# Altium schematic sheet PERIPHERALS.SchDoc: PERIPHERALS
size A3; ApprovedBy: TRAN VAN THANG; Author: MINH NHAT; Revision: 6.6.6; SheetNumber: 5; SheetTotal: 6; ProjectTitle: LOAPAY 4G WIFI
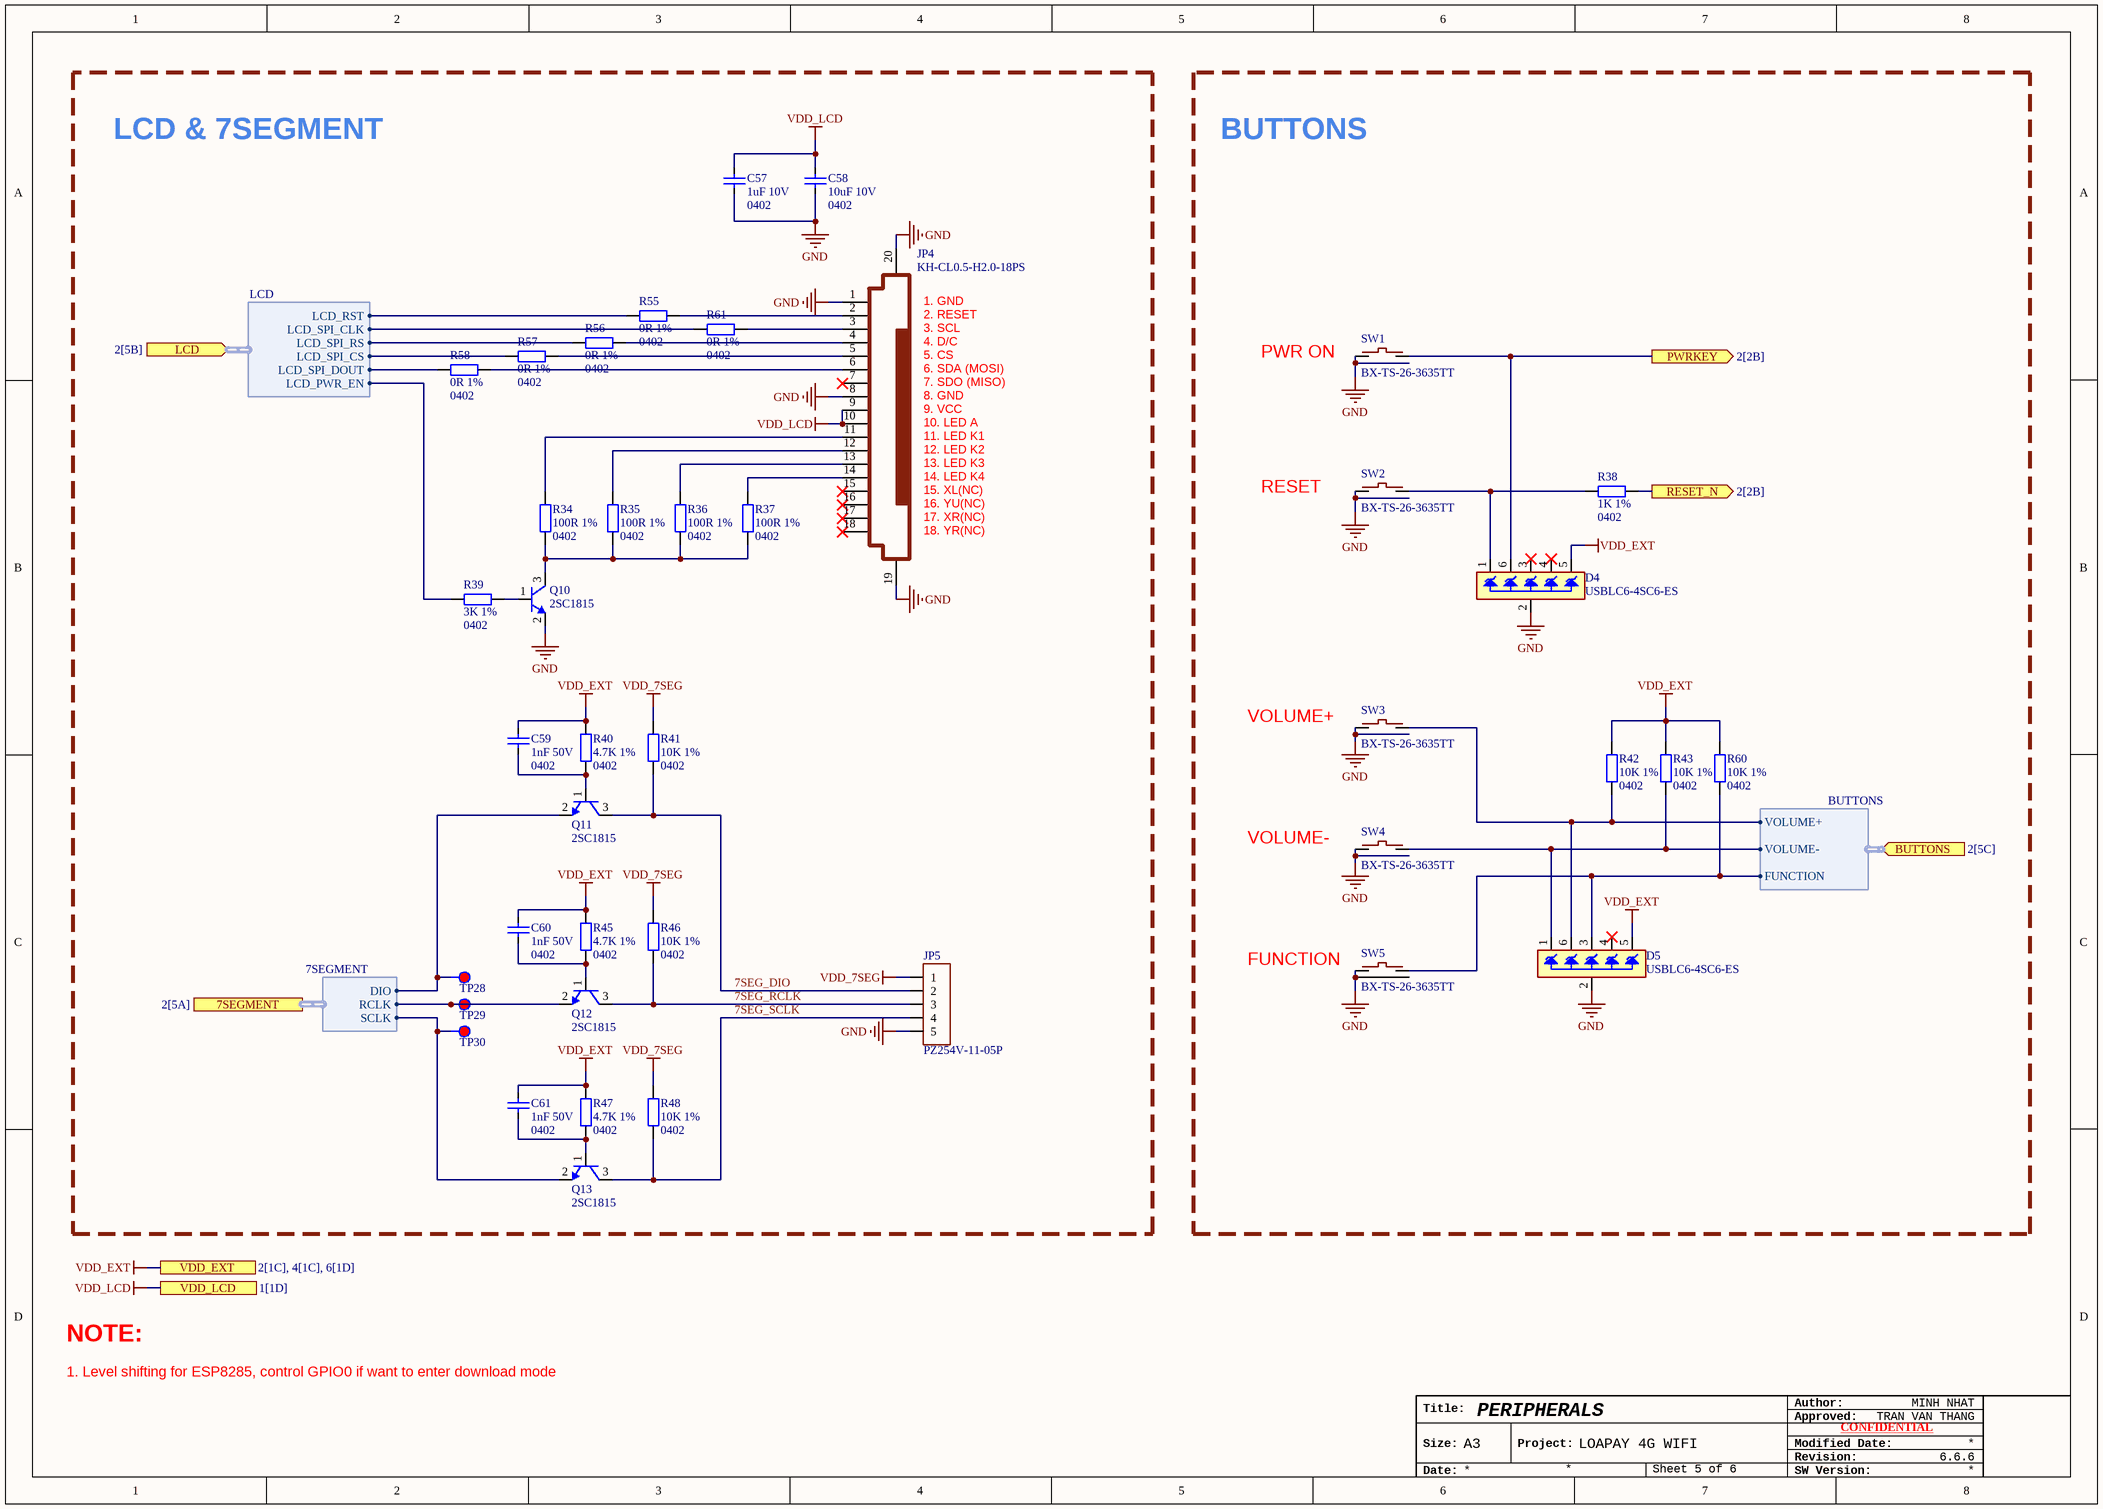
[diagram p0: PERIPHERALS.SchDoc]

## Parts
C57  1uF 10V  Package: 0402  [C0402_2]
C58  10uF 10V  Package: 0402  [C0402_2]
C59  1nF 50V  Package: 0402  [C0402_2]
C60  1nF 50V  Package: 0402  [C0402_2]
C61  1nF 50V  Package: 0402  [C0402_2]
D4  USBLC6-4SC6-ES  [D_SOT23-6]
D5  USBLC6-4SC6-ES  [D_SOT23-6]
JP4  KH-CL0.5-H2.0-18PS  [FPC-SMD-18P-TOP]
JP5  PZ254V-11-05P  [JP5_M_SMD - 2]
Q10  2SC1815  [TF_SOT_23_3]
Q11  2SC1815  [TF_SOT_23_3]
Q12  2SC1815  [TF_SOT_23_3]
Q13  2SC1815  [TF_SOT_23_3]
R34  100R 1%  Package: 0402  [RES_SMD_0402]
R35  100R 1%  Package: 0402  [RES_SMD_0402]
R36  100R 1%  Package: 0402  [RES_SMD_0402]
R37  100R 1%  Package: 0402  [RES_SMD_0402]
R38  1K 1%  Package: 0402  [RES_SMD_0402]
R39  3K 1%  Package: 0402  [RES_SMD_0402]
R40  4.7K 1%  Package: 0402  [RES_SMD_0402]
R41  10K 1%  Package: 0402  [RES_SMD_0402]
R42  10K 1%  Package: 0402  [RES_SMD_0402]
R43  10K 1%  Package: 0402  [RES_SMD_0402]
R45  4.7K 1%  Package: 0402  [RES_SMD_0402]
R46  10K 1%  Package: 0402  [RES_SMD_0402]
R47  4.7K 1%  Package: 0402  [RES_SMD_0402]
R48  10K 1%  Package: 0402  [RES_SMD_0402]
R55  0R 1%  Package: 0402  [RES_SMD_0402]
R56  0R 1%  Package: 0402  [RES_SMD_0402]
R57  0R 1%  Package: 0402  [RES_SMD_0402]
R58  0R 1%  Package: 0402  [RES_SMD_0402]
R60  10K 1%  Package: 0402  [RES_SMD_0402]
R61  0R 1%  Package: 0402  [RES_SMD_0402]
SW1  BX-TS-26-3635TT  [BX-TS-26-3635TT]
SW2  BX-TS-26-3635TT  [BX-TS-26-3635TT]
SW3  BX-TS-26-3635TT  [BX-TS-26-3635TT]
SW4  BX-TS-26-3635TT  [BX-TS-26-3635TT]
SW5  BX-TS-26-3635TT  [BX-TS-26-3635TT]
TP28  Test Point  [TEST_POINT]  (value not drawn)  (no BOM)
TP29  Test Point  [TEST_POINT]  (value not drawn)  (no BOM)
TP30  Test Point  [TEST_POINT]  (value not drawn)  (no BOM)

## Blocks framed on the sheet
LCD & 7SEGMENT: C57-C61 JP4 JP5 Q10-Q13 R34-R37 R39-R41 R45-R48 R55-R58 R61 TP28-TP30
BUTTONS: D4 D5 R38 R42 R43 R60 SW1-SW5

## Ports
7SEGMENT (harness 7SEGMENT, see 2[5A]), BUTTONS (in, harness BUTTONS, see 2[5C]), LCD (in, harness LCD, see 2[5B]), PWRKEY (out, see 2[2B]), RESET_N (out, see 2[2B]), VDD_EXT (see 2[1C], 4[1C], 6[1D]), VDD_LCD (see 1[1D])

## Harnesses
BUTTONS: VOLUME+, VOLUME-, FUNCTION
LCD: LCD_RST, LCD_SPI_CLK, LCD_SPI_RS, LCD_SPI_CS, LCD_SPI_DOUT, LCD_PWR_EN
7SEGMENT: SCLK, RCLK, DIO

## Nets
GND: C57.1 C58.1 D4.2 D5.2 JP4.1 JP4.8 JP4.19 JP4.20 JP5.5 Q10.2(E) SW1.1 SW1.3 SW1.4 SW2.1 SW2.3 SW2.4 SW3.2 SW3.3 SW3.4 SW4.2 SW4.3 SW4.4 SW5.1 SW5.4
VDD_7SEG: JP5.1 R41.2 R46.2 R48.2
VDD_EXT: C59.2 C60.2 C61.2 D4.5 D5.5 R40.2 R42.2 R43.2 R45.2 R47.2 R60.2 ; port VDD_EXT
VDD_LCD: C57.2 C58.2 JP4.9 JP4.10 ; port VDD_LCD
7SEG_DIO: JP5.2 Q11.3(C) R41.1
7SEG_RCLK: JP5.3 Q12.3(C) R46.1
7SEG_SCLK: JP5.4 Q13.3(C) R48.1
PWRKEY: D4.6 SW1.2 ; port PWRKEY
RESET_N: R38.2 ; port RESET_N
NetC59_1: C59.1 Q11.1(B) R40.1
NetC60_1: C60.1 Q12.1(B) R45.1
NetC61_1: C61.1 Q13.1(B) R47.1
NetD4_1: D4.1 R38.1 SW2.2
NetD5_1: D5.1 R43.1 SW4.1 ; port BUTTONS.VOLUME-
NetD5_3: D5.3 R60.1 SW5.2 ; port BUTTONS.FUNCTION
NetD5_6: D5.6 R42.1 SW3.1 ; port BUTTONS.VOLUME+
NetJP4_2: JP4.2 R55.2
NetJP4_3: JP4.3 R61.2
NetJP4_4: JP4.4 R56.2
NetJP4_5: JP4.5 R57.2
NetJP4_6: JP4.6 R58.2
NetJP4_11: JP4.11 R34.2
NetJP4_12: JP4.12 R35.2
NetJP4_13: JP4.13 R36.2
NetJP4_14: JP4.14 R37.2
NetQ10_1: Q10.1(B) R39.2
NetQ10_3: Q10.3(C) R34.1 R35.1 R36.1 R37.1
NetQ11_2: Q11.2(E) TP28.1 ; port 7SEGMENT.DIO
NetQ12_2: Q12.2(E) TP29.1 ; port 7SEGMENT.RCLK
NetQ13_2: Q13.2(E) TP30.1 ; port 7SEGMENT.SCLK
NetR39_1: R39.1 ; port LCD.LCD_PWR_EN
NetR55_1: R55.1 ; port LCD.LCD_RST
NetR56_1: R56.1 ; port LCD.LCD_SPI_RS
NetR57_1: R57.1 ; port LCD.LCD_SPI_CS
NetR58_1: R58.1 ; port LCD.LCD_SPI_DOUT
NetR61_1: R61.1 ; port LCD.LCD_SPI_CLK

Not connected (* = marked no-connect by the designer): D4 3* 4*; D5 4*; JP4 7* 15* 16* 17* 18*; SW5 3

## Notes on the sheet
- (near JP4) 1. GND
- (near JP4) 2. RESET
- (near JP4) 3. SCL
- (near JP4) 4. D/C
- (near JP4) 5. CS
- (near JP4) 6. SDA (MOSI)
- (near SW1) PWR ON
- (near JP4) 7. SDO (MISO)
- (near JP4) 8. GND
- (near JP4) 9. VCC
- (near JP4) 10. LED A
- (near JP4) 12. LED K2
- (near JP4) 11. LED K1
- (near JP4) 13. LED K3
- (near JP4) 14. LED K4
- (near JP4) 15. XL(NC)
- (near JP4) 16. YU(NC)
- RESET
- (near JP4) 17. XR(NC)
- (near JP4) 18. YR(NC)
- VOLUME+
- VOLUME-
- (near SW5) FUNCTION
- NOTE:
- 1. Level shifting for ESP8285, control GPIO0 if want to enter download mode
- Author:
- Title:
- Size:
- A3
- Project:
- Approved:
- Revision:
- Modified Date:
- CONFIDENTIAL
- Date:
- SW Version:

## Library data of the parts
C57 = C0402_MLCC_1uF_10V: 10V 1uF X5R ±10% 0402 Multilayer Ceramic Capacitors MLCC - SMD/SMT ROHS; Manufacturer: Samsung Electro-Mechanics; Manufacture Part Number: CL05A105KP5NNNC; Packaging: Cut Tape (CT); Tolerance: ±10%; Link: https://www.lcsc.com/product-detail/Multilayer-Ceramic-Capacitors-MLCC-SMD-SMT_Samsung-Electro-Mechanics-CL05A105KP5NNNC_C14445.html?s_z=n_0402%201uF; LCSC Part: C14445
C58 = C0402_MLCC_10uF_10V: 10V 10uF X5R ±20% 0402 Multilayer Ceramic Capacitors MLCC - SMD/SMT ROHS; Manufacturer: Samsung Electro-Mechanics; Manufacture Part Number: CL05A106MP5NUNC; Packaging: Cut Tape (CT); Tolerance: ±20%; Link: https://www.lcsc.com/product-detail/Multilayer-Ceramic-Capacitors-MLCC-SMD-SMT_Samsung-Electro-Mechanics-CL05A106MP5NUNC_C315248.html?s_z=n_10uF%2050V%200402; LCSC Part: C315248
C59-C61 = C0402_MLCC_1nF_50V: 50V 1nF X7R ±10% 0402 Multilayer Ceramic Capacitors MLCC - SMD/SMT ROHS; Manufacturer: Murata Electronics; Manufacture Part Number: GCM155R71H102KA37J; Packaging: Cut Tape (CT); Tolerance: ±10%; ComponentLink1Description: Link LCSC; Link: https://www.lcsc.com/product-detail/Multilayer-Ceramic-Capacitors-MLCC-SMD-SMT_Murata-Electronics-GCM155R71H102KA37J_C1852263.html?s_z=n_1nF%200402; LCSC Part: C1852263
D4 D5 = USBLC6-4SC6-ES: 4.5A 60W 12V 6V Unidirectional 5V SOT23-6 ESD and Surge Protection (TVS/ESD) ROHS; Manufacturer: ElecSuper; Manufacture Part Number: USBLC6-4SC6-ES; Packaging: Cut Tape; Link: https://www.lcsc.com/product-detail/ESD-and-Surge-Protection-TVS-ESD_ElecSuper-USBLC6-4SC6-ES_C5180279.html?s_z=n_USBLC6-4SC6; Package: SOT23-6; LCSC Part: C5180279
JP4 = KH-CL0.5-H2.0-18PS: Drawer Type -25℃~+85℃ 18P Contact,Top Horizontal attachment 0.5mm SMD,P=0.5mm,Surface Mount，Right Angle FFC, FPC (Flat Flexible) Connector Assemblies ROHS; Manufacturer: Shenzhen Kinghelm Elec; Manufacture Part Number: KH-CL0.5-H2.0-18PS; Packaging: Cut Tape; Link: https://www.lcsc.com/product-detail/FFC-FPC-Flat-Flexible-Connector-Assemblies_Shenzhen-Kinghelm-Elec-KH-CL0-5-H2-0-18PS_C2828051.html; Package: SMD,P=0.5mm,Surface Mount，Right Angle; LCSC Part: C2828051
JP5 = XFCN PZ254V-11-05P: Policy 2.5mm 5P 6mm -40℃~+105℃ 3mm 2.54mm Single Row Black Brass 1x5P Plugin,P=2.54mm Pin Headers ROHS; Manufacturer: XFCN; Manufacture Part Number: PZ254V-11-05P; Packaging: Cut Tape; Link: https://www.lcsc.com/product-detail/Pin-Headers_XFCN-PZ254V-11-05P_C492404.html?s_z=n_XFCN%20PZ254V-11-05P; Package: Plugin,P=2.54mm; LCSC Part: C492404
Q10-Q13 = 2SC1815: 50V 200mW 200@2mA,6V 150mA NPN SOT-23 Bipolar (BJT) ROHS; Manufacturer: Guangdong Hottech; Current - Collector Cutoff: 100nA; Transition frequency(fT): 80MHz; Vce Saturation(VCE(sat)): 250mV; Manufacture Part Number: 2SC1815; Packaging: Cut Tape (CT); Link: https://www.lcsc.com/product-detail/Bipolar-BJT_Guangdong-Hottech-2SC1815_C181171.html?s_z=n_c1815; Collector - Emitter Voltage VCEO: 50V; Pd - Power Dissipation: 200mW; DC Current Gain: 200@2mA,6V; Current - Collector(Ic): 150mA; Package: SOT-23-3; LCSC Part: C181171
R34-R37 = R0402_100R: 100 Ohms ±1% 0.063W, 1/16W Chip Resistor 0402 (1005 Metric) Automotive AEC-Q200, Moisture Resistant Thick Film; Manufacturer: YAGEO; Manufacture Part Number: AC0402FR-13100RL; Packaging: Cut Tape (CT); Link: https://www.lcsc.com/product-detail/Chip-Resistor-Surface-Mount_YAGEO-AC0402FR-13100RL_C4553535.html?s_z=n_AC0402FR-13100RL; Tolerance: ±1%; Link Digikey: https://www.digikey.com/en/products/detail/yageo/AC0402FR-13100RL/13694174; LCSC Part: C4553535
R38 = R0402_1K: 1 kOhms ±1% 0.063W, 1/16W Chip Resistor 0402 (1005 Metric) Moisture Resistant Thick Film; Manufacturer: YAGEO; Manufacture Part Number: RC0402FR-071KL; Packaging: Cut Tape (CT); Link: https://www.lcsc.com/product-detail/Chip-Resistor-Surface-Mount_YAGEO-RC0402FR-071KL_C106235.html?s_z=n_RC0402FR-071KL; Tolerance: ±1%; Link Digikey: https://www.digikey.com/en/products/detail/yageo/RC0402FR-071KL/726513; LCSC Part: C106235
R39 = R0402_3K: 3 kOhms ±1% 0.063W, 1/16W Chip Resistor 0402 (1005 Metric) Automotive AEC-Q200, Moisture Resistant Thick Film; Manufacturer: YAGEO; Manufacture Part Number: AC0402FR-073KL; Packaging: Cut Tape (CT); Link: https://www.lcsc.com/product-detail/Chip-Resistor-Surface-Mount_YAGEO-AC0402FR-073KL_C144761.html?s_z=n_AC0402FR-073KL; Tolerance: ±1%; Link Digikey: https://www.digikey.com/en/products/detail/yageo/AC0402FR-073KL/5895335; LCSC Part: C144761
R40 R45 R47 = R0402_4.7K: 4.7 kOhms ±1% 0.063W, 1/16W Chip Resistor 0402 (1005 Metric) Thick Film; Manufacturer: YAGEO; Manufacture Part Number: RC0402FR-074K7P; Packaging: Cut Tape (CT); Link: https://www.lcsc.com/product-detail/Chip-Resistor-Surface-Mount_YAGEO-RC0402FR-074K7P_C851841.html?s_z=n_RC0402FR-074K7P; Tolerance: ±1%; Link Digikey: https://www.digikey.com/en/products/detail/yageo/RC0402FR-074K7P/4935287; LCSC Part: C851841
R41-R43 R46 R48 R60 = R0402_10K: 10 kOhms ±1% 0.063W, 1/16W Chip Resistor 0402 (1005 Metric) Moisture Resistant Thick Film; Manufacturer: YAGEO; Manufacture Part Number: RC0402FR-0710KL; Packaging: Cut Tape (CT); Link: https://www.lcsc.com/product-detail/Chip-Resistor-Surface-Mount_YAGEO-RC0402FR-0710KL_C60490.html?s_z=n_RC0402FR-0710KL; Tolerance: ±1%; Link Digikey: https://www.digikey.com/en/products/detail/yageo/RC0402FR-0710KL/726523; LCSC Part: C60490
R55-R58 R61 = R0402_0R: 0 Ohms Jumper Chip Resistor 0402 (1005 Metric) Moisture Resistant Thick Film; Manufacturer: YAGEO; Manufacture Part Number: RC0402JR-070RL; Packaging: Cut Tape (CT); Link Digikey: https://www.digikey.com/en/products/detail/yageo/RC0402JR-070RL/726406; Tolerance: ±1%; LCSC Part: C60485; Link: https://www.lcsc.com/product-detail/Chip-Resistor-Surface-Mount_YAGEO-RC0402JR-070RL_C60485.html?s_z=n_RC0402JR-070RL
SW1-SW5 = BX-TS-26-3635TT: Without bracket 50mA 3.6mm 100000 Times 260gf 12V 3.5mm 3.5mm Rectangle button Standing paste SPST SMD,3x6mm Tactile Switches ROHS; Manufacturer: Bossie; Manufacture Part Number: C18078107; Packaging: Cut Tape; Link: https://www.lcsc.com/product-detail/Tactile-Switches_Bossie-BX-TS-26-3635TT_C18078107.html?s_z=n_tactile; Package: SMD,3x6mm; LCSC Part: C18078107
TP28-TP30 = TEST_POINT